# EAGLE design gpi-bottom (EAGLE 7.1.0)
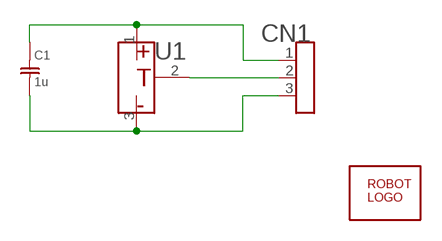
[diagram p0: schematic, sheet 1]

## Parts
C1  1u  C0603  [SMD0603]
CN1  HEADER-3X12MM  [HEADER-3X1-2SMD]
U1  TEMPERATURE  [SOT-23]
U$1  ROBOTMAN-LOGO  [ROBOTMAN-LOGO]

## Nets
N$1: C1.1 CN1.1 U1.1(V)
N$2: CN1.2 U1.2(OUT)
N$3: C1.2 CN1.3 U1.3(G)

## Library data of the parts
C1 = jaw:C
CN1 = jaw:HEADER-3X1
U1 = jaw:TEMPERATURE
U$1 = jaw:ROBOTMAN-LOGO

## Board
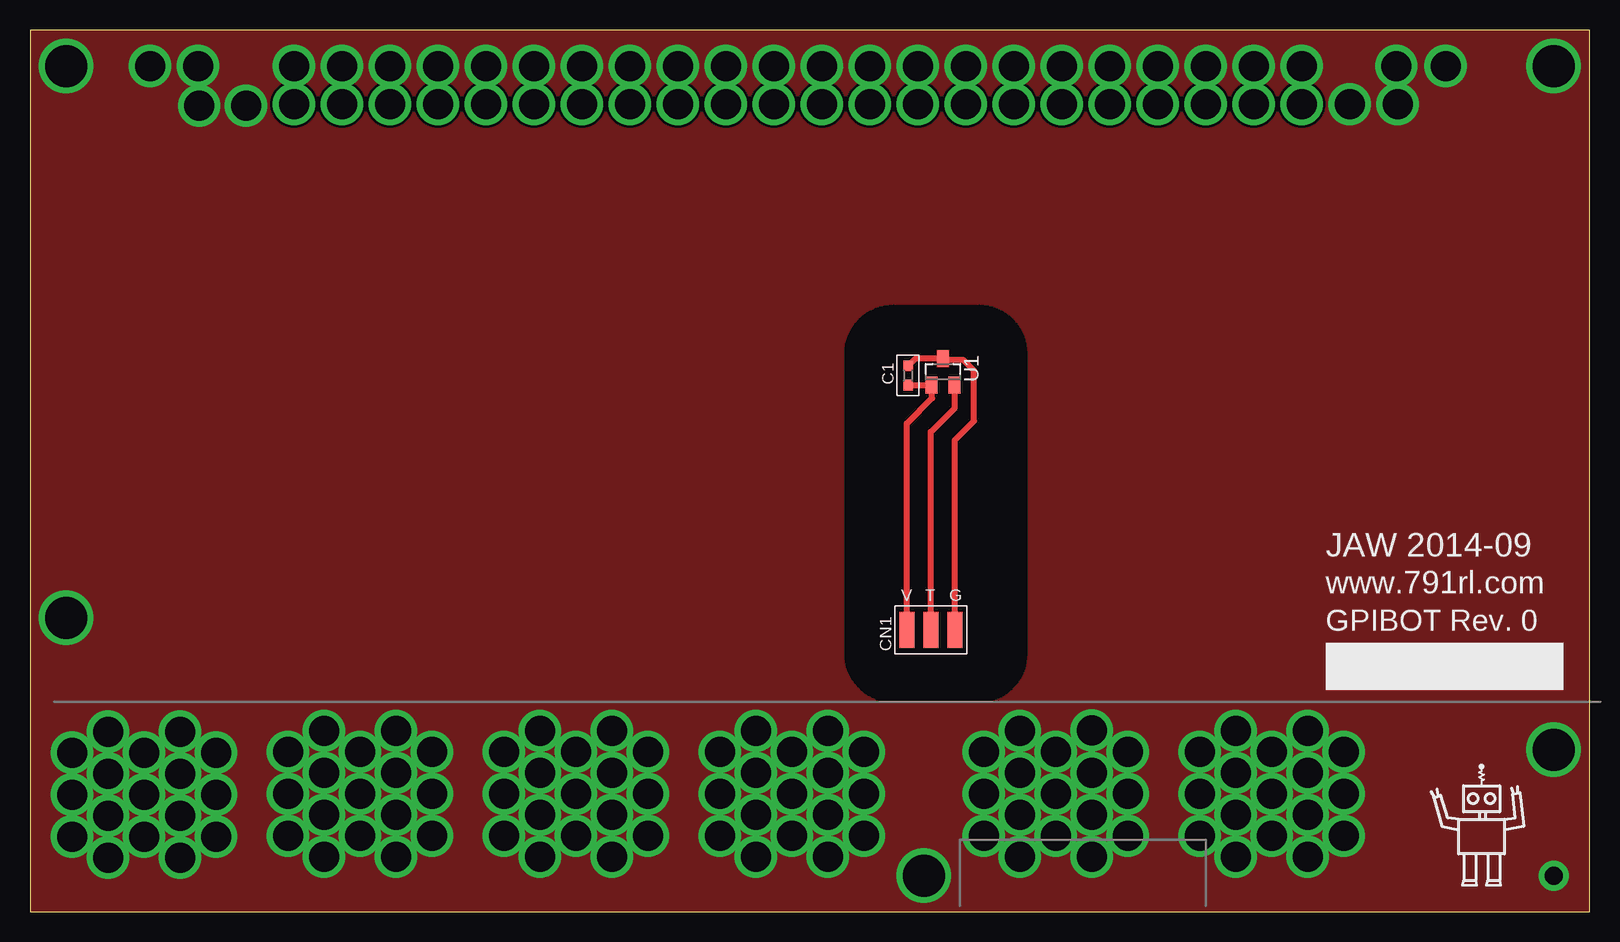
[diagram p1: board, top side]
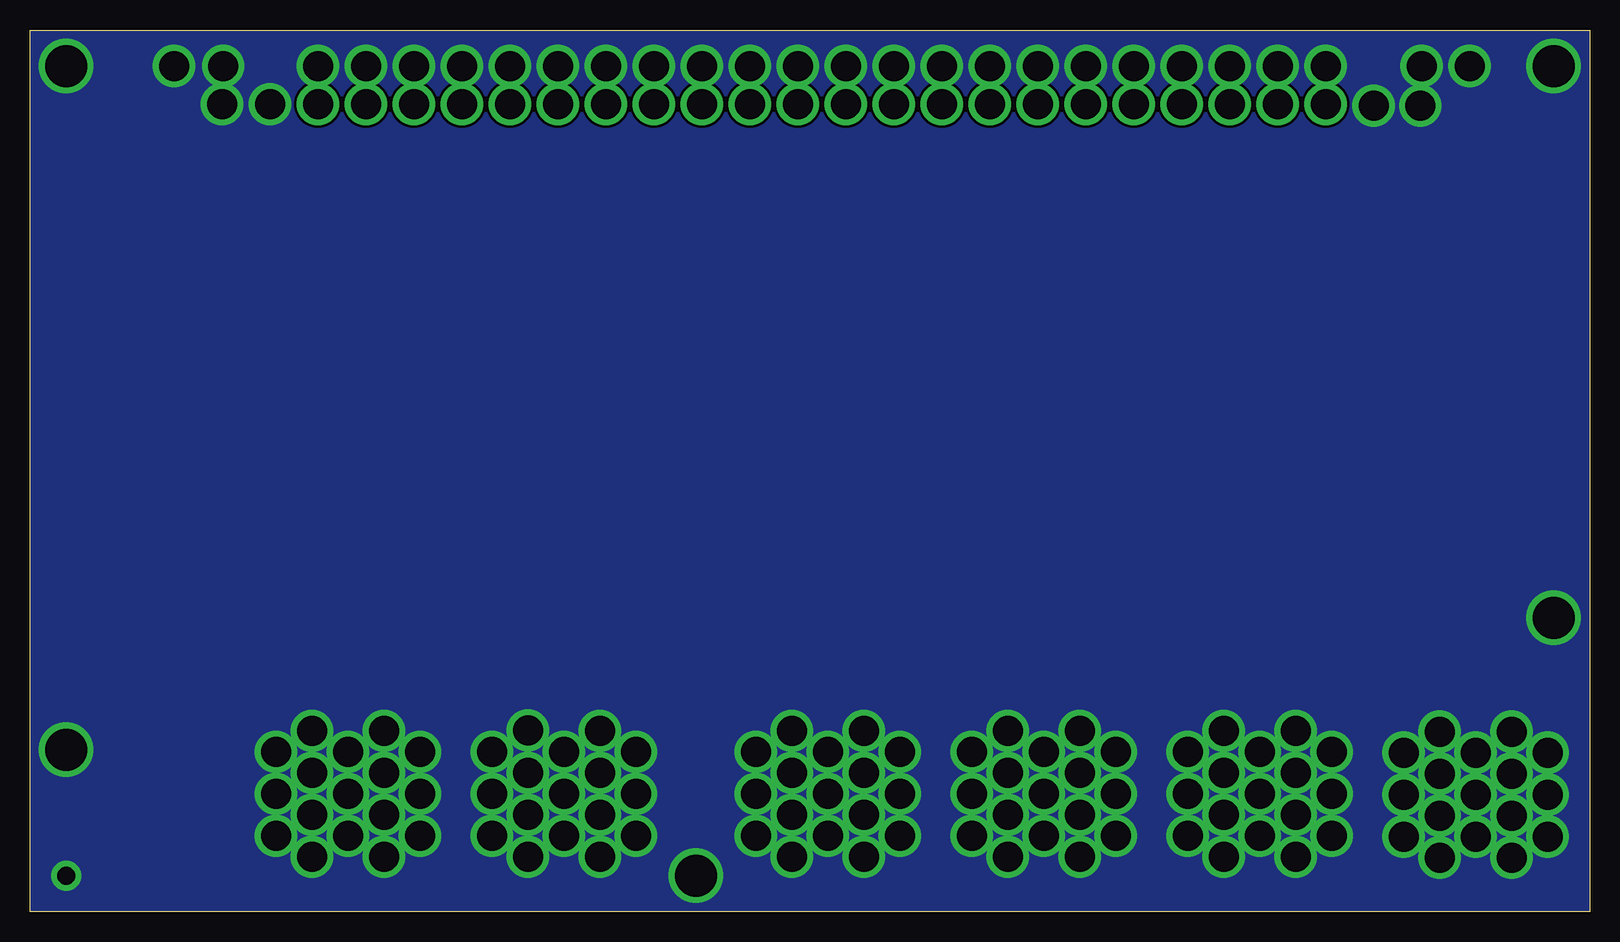
[diagram p2: board, bottom side, seen from below]

Size 130 x 73.5 mm. Coordinates in mm from the lower left corner, seen from the top.
Outline: 130,0 130,73.5 0,73.5 0,0 130,0
Copper layers (1*16): Top 0.035mm / dielectric 1.5mm / Bottom 0.035mm
Design rules "default *": minimum track width 0.25mm, minimum drill 24mil, track to track 8mil, track to pad 8mil, pad to pad 8mil, via to via 8mil, smd to smd 8mil, copper to edge 1mil, drill to drill 8mil, minimum pad ring 10mil, minimum via ring 8mil, stop-mask expansion 4mil, vias tented up to drill 0mil, thermal gap 10mil

### Footprints (pad centres in the part's own frame; a part is rotated, then mirrored left to right if it is on the bottom)
SMD0603 = smd 0.9 x 0.8: 1 -0.8,0; 2 0.8,0
HEADER-3X1-2SMD = smd 1.25 x 3: 1 -2,0; 2 0,0; 3 2,0
SOT-23 = smd 1 x 1.4: 1 -0.95,-1.1; 2 0.95,-1.1; 3 0,1.1

### Placement (x,y rotation side)
C1  73.2,44.7 90 top
CN1  75.1,23.5 0 top
U1  76.1,45 0 top
U$1  121,6.5 0 top

### Tracks (layer width: path | path; a pad name or v marks a point on that pad's centre or on a via)
N$1
  Top 0.5: 73.1,43.66 arc-45 C1.1 U1.1 75.2,43.85 75.2,42.8 73.1,40.7 CN1.1
N$2
  Top 0.5: CN1.2 75.1,40 77.1,42 77.1,43.85 U1.2
N$3
  Top 0.5: CN1.3 77.1,39.3 78.7,40.9 78.7,45.1 77.8,46 76.2,46 U1.3 73.8,46.1 C1.2
N$4
  cutout Top: 71.99,50.5 79.1,50.5 arc-90 83,46.5 83,21.51 arc-90 79.19,17.5 72,17.5 arc-90 68,21.5 68,46.48 arc-90
S$1  (via drill 1.5 pad 2.5, 2.5, 3.5)
  other vias: 3,70.5 10,70.5 14,70.5 22,70.5 26,70.5 127,70.5 3,24.5 74.5,3 3.5,6.25 6.5,4.5 6.5,8 3.5,9.75 6.5,11.5 3.5,13.25 6.5,15 9.5,6.25 12.5,4.5 12.5,8 9.5,9.75 12.5,11.5 9.5,13.25 12.5,15 15.5,6.25 15.5,9.75 15.5,13.25 21.5,6.3 24.5,4.55 100.5,8.05 100.5,11.55 100.5,15.05 100.5,4.55 102,70.5 103.5,9.8 103.5,13.3 103.5,6.3 106,70.5 106.5,8.05 106.5,11.55 106.5,15.05 106.5,4.55 113.9,70.5 109.5,9.8 109.5,13.3 109.5,6.3 118,70.5 21.5,9.8 21.5,13.3 24.5,8.05 24.5,11.55 24.5,15.05 27.5,9.8 27.5,13.3 27.5,6.3 30.5,8.05 30.5,11.55 30.5,15.05 30.5,4.55 30,70.5 33.5,9.8 33.5,13.3 33.5,6.3 34,70.5 38,70.5 39.5,9.8 39.5,13.3 39.5,6.3 42.5,8.05 42.5,11.55 42.5,15.05 42.5,4.55 42,70.5 45.5,9.8 45.5,13.3 45.5,6.3 46,70.5 48.5,8.05 48.5,11.55 48.5,15.05 48.5,4.55 50,70.5 51.5,9.8 51.5,13.3 51.5,6.3 54,70.5 57.5,9.8 57.5,13.3 57.5,6.3 58,70.5 62,70.5 60.5,11.55 60.5,15.05 60.5,4.55 60.5,8.05 66.5,8.05 66.5,11.55 66.5,15.05 66.5,4.55 66,70.5 69.5,9.8 69.5,13.3 69.5,6.3 70,70.5 63.5,6.3 63.5,9.8 63.5,13.3 74,70.5 88.5,4.55 88.5,8.05 88.5,11.55 78,70.5 79.5,9.8 79.5,13.3 79.5,6.3 82,70.5 82.5,8.05 82.5,11.55 82.5,15.05 82.5,4.55 86,70.5 85.5,9.8 85.5,13.3 85.5,6.3 90,70.5 91.5,9.8 91.5,13.3 88.5,15.1 91.5,6.3 94,70.5 98,70.5 97.5,9.8 97.5,13.3 97.5,6.3 127,13.5 127,3 14.1,67.2 18,67.2 114,67.3 110,67.3
  pour Bottom (no thermals): -1.1,74.6 133.9,74.6 133.9,-0.4 -1.1,-0.4
  pour Top (no thermals): -0.9,74.4 134.1,74.4 134.1,-0.6 -0.9,-0.6
S$2  (via drill 2.5)
  other vias: 22,67.3 26,67.3 102,67.3 106,67.3 30,67.3 34,67.3 38,67.3 42,67.3 46,67.3 50,67.3 54,67.3 58,67.3 62,67.3 66,67.3 70,67.3 74,67.3 78,67.3 82,67.3 86,67.3 90,67.3 94,67.3 98,67.3

### Text on the board
tPlace: JAW 2014-09 | www.791rl.com | V | T | G | GPIBOT Rev. 0